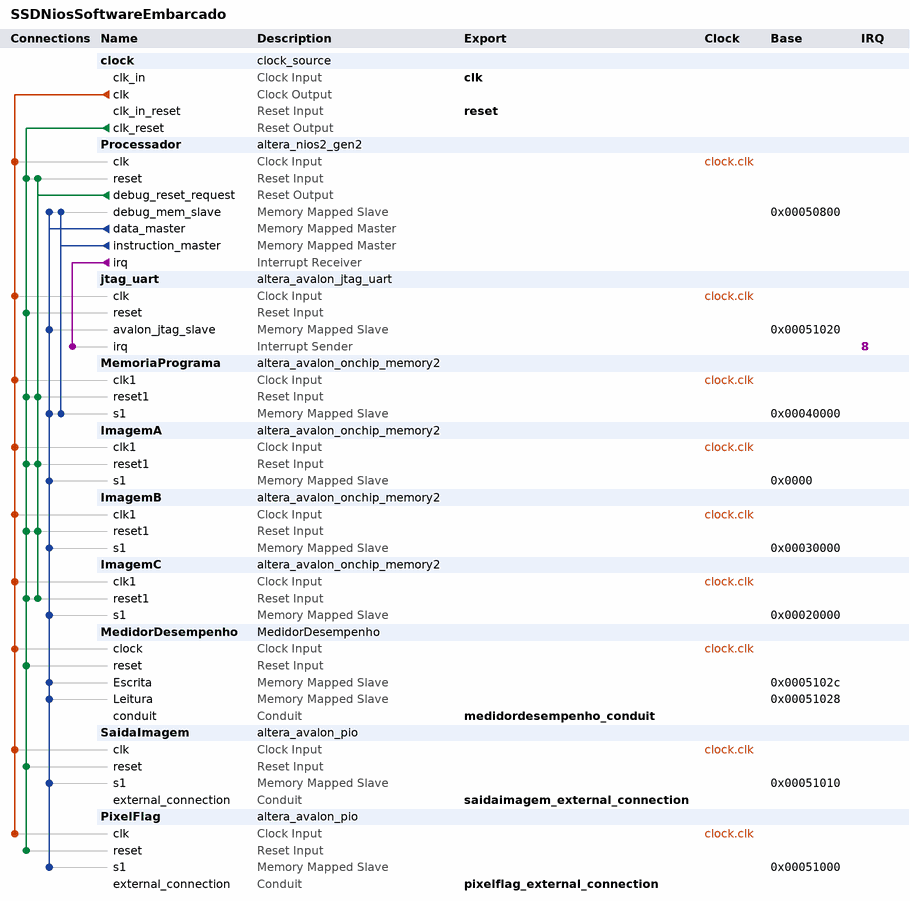
[diagram p0: system contents]
# Platform Designer (Qsys) system SSDNiosSoftwareEmbarcado, Cyclone IV E EP4CE115F29C7
# Parameters at their usual value, and those the tool derives, are not listed.
package require -exact qsys 18.1
create_system SSDNiosSoftwareEmbarcado
set_project_property DEVICE_FAMILY {Cyclone IV E}
set_project_property DEVICE EP4CE115F29C7

add_instance clock clock_source 18.1
set_instance_parameter_value clock clockFrequency 50000000

add_instance Processador altera_nios2_gen2 18.1
set_instance_parameter_value Processador dcache_size 2048
set_instance_parameter_value Processador exceptionSlave MemoriaPrograma.s1
set_instance_parameter_value Processador icache_size 4096
set_instance_parameter_value Processador impl Tiny
set_instance_parameter_value Processador resetSlave MemoriaPrograma.s1

add_instance jtag_uart altera_avalon_jtag_uart 18.1
set_instance_parameter_value jtag_uart simInteractiveOptions NO_INTERACTIVE_WINDOWS

add_instance MemoriaPrograma altera_avalon_onchip_memory2 18.1
set_instance_parameter_value MemoriaPrograma dataWidth 8
set_instance_parameter_value MemoriaPrograma dualPort false
set_instance_parameter_value MemoriaPrograma initMemContent true
set_instance_parameter_value MemoriaPrograma initializationFileName onchip_mem.hex
set_instance_parameter_value MemoriaPrograma memorySize 65536

add_instance ImagemA altera_avalon_onchip_memory2 18.1
set_instance_parameter_value ImagemA allowInSystemMemoryContentEditor true
set_instance_parameter_value ImagemA dataWidth 8
set_instance_parameter_value ImagemA dualPort false
set_instance_parameter_value ImagemA initMemContent true
set_instance_parameter_value ImagemA initializationFileName C:/Projetos/Quartus/SSDNiosSoftware/ImagemA.mif
set_instance_parameter_value ImagemA instanceID DATA
set_instance_parameter_value ImagemA memorySize 65536
set_instance_parameter_value ImagemA useNonDefaultInitFile true
set_instance_parameter_value ImagemA writable false

add_instance ImagemB altera_avalon_onchip_memory2 18.1
set_instance_parameter_value ImagemB allowInSystemMemoryContentEditor true
set_instance_parameter_value ImagemB dataWidth 8
set_instance_parameter_value ImagemB dualPort false
set_instance_parameter_value ImagemB initMemContent true
set_instance_parameter_value ImagemB initializationFileName C:/Projetos/Quartus/SSDNiosSoftware/ImagemB.mif
set_instance_parameter_value ImagemB instanceID DATA
set_instance_parameter_value ImagemB memorySize 65536
set_instance_parameter_value ImagemB useNonDefaultInitFile true
set_instance_parameter_value ImagemB writable false

add_instance ImagemC altera_avalon_onchip_memory2 18.1
set_instance_parameter_value ImagemC dataWidth 8
set_instance_parameter_value ImagemC dualPort false
set_instance_parameter_value ImagemC initMemContent true
set_instance_parameter_value ImagemC initializationFileName onchip_mem.hex
set_instance_parameter_value ImagemC memorySize 65536

add_instance MedidorDesempenho MedidorDesempenho 1.0

add_instance SaidaImagem altera_avalon_pio 18.1
set_instance_parameter_value SaidaImagem direction Output
set_instance_parameter_value SaidaImagem width 8

add_instance PixelFlag altera_avalon_pio 18.1
set_instance_parameter_value PixelFlag direction Output
set_instance_parameter_value PixelFlag width 1

# connections
add_connection clock.clk ImagemA.clk1 clock
add_connection clock.clk ImagemB.clk1 clock
add_connection clock.clk ImagemC.clk1 clock
add_connection clock.clk jtag_uart.clk clock
add_connection clock.clk MedidorDesempenho.clock clock
add_connection clock.clk MemoriaPrograma.clk1 clock
add_connection clock.clk PixelFlag.clk clock
add_connection clock.clk Processador.clk clock
add_connection clock.clk SaidaImagem.clk clock
add_connection clock.clk_reset ImagemA.reset1 reset
add_connection clock.clk_reset ImagemB.reset1 reset
add_connection clock.clk_reset ImagemC.reset1 reset
add_connection clock.clk_reset jtag_uart.reset reset
add_connection clock.clk_reset MedidorDesempenho.reset reset
add_connection clock.clk_reset MemoriaPrograma.reset1 reset
add_connection clock.clk_reset PixelFlag.reset reset
add_connection clock.clk_reset Processador.reset reset
add_connection clock.clk_reset SaidaImagem.reset reset
add_connection Processador.debug_reset_request ImagemA.reset1 reset
add_connection Processador.debug_reset_request ImagemB.reset1 reset
add_connection Processador.debug_reset_request ImagemC.reset1 reset
add_connection Processador.debug_reset_request MemoriaPrograma.reset1 reset
add_connection Processador.debug_reset_request Processador.reset reset
add_connection Processador.data_master ImagemA.s1 avalon
set_connection_parameter_value Processador.data_master/ImagemA.s1 baseAddress 0x0000
add_connection Processador.data_master ImagemB.s1 avalon
set_connection_parameter_value Processador.data_master/ImagemB.s1 baseAddress 0x00030000
add_connection Processador.data_master ImagemC.s1 avalon
set_connection_parameter_value Processador.data_master/ImagemC.s1 baseAddress 0x00020000
add_connection Processador.data_master jtag_uart.avalon_jtag_slave avalon
set_connection_parameter_value Processador.data_master/jtag_uart.avalon_jtag_slave baseAddress 0x00051020
add_connection Processador.data_master MedidorDesempenho.Escrita avalon
set_connection_parameter_value Processador.data_master/MedidorDesempenho.Escrita baseAddress 0x0005102c
add_connection Processador.data_master MedidorDesempenho.Leitura avalon
set_connection_parameter_value Processador.data_master/MedidorDesempenho.Leitura baseAddress 0x00051028
add_connection Processador.data_master MemoriaPrograma.s1 avalon
set_connection_parameter_value Processador.data_master/MemoriaPrograma.s1 baseAddress 0x00040000
add_connection Processador.data_master PixelFlag.s1 avalon
set_connection_parameter_value Processador.data_master/PixelFlag.s1 baseAddress 0x00051000
add_connection Processador.data_master Processador.debug_mem_slave avalon
set_connection_parameter_value Processador.data_master/Processador.debug_mem_slave baseAddress 0x00050800
add_connection Processador.data_master SaidaImagem.s1 avalon
set_connection_parameter_value Processador.data_master/SaidaImagem.s1 baseAddress 0x00051010
add_connection Processador.instruction_master MemoriaPrograma.s1 avalon
set_connection_parameter_value Processador.instruction_master/MemoriaPrograma.s1 baseAddress 0x00040000
add_connection Processador.instruction_master Processador.debug_mem_slave avalon
set_connection_parameter_value Processador.instruction_master/Processador.debug_mem_slave baseAddress 0x00050800
add_connection Processador.irq jtag_uart.irq interrupt
set_connection_parameter_value Processador.irq/jtag_uart.irq irqNumber 8

# exported interfaces
add_interface clk clock sink
set_interface_property clk EXPORT_OF clock.clk_in
add_interface medidordesempenho_conduit conduit end
set_interface_property medidordesempenho_conduit EXPORT_OF MedidorDesempenho.conduit
add_interface pixelflag_external_connection conduit end
set_interface_property pixelflag_external_connection EXPORT_OF PixelFlag.external_connection
add_interface reset reset sink
set_interface_property reset EXPORT_OF clock.clk_in_reset
add_interface saidaimagem_external_connection conduit end
set_interface_property saidaimagem_external_connection EXPORT_OF SaidaImagem.external_connection

set_interconnect_requirement {$system} qsys_mm.clockCrossingAdapter HANDSHAKE
set_interconnect_requirement {$system} qsys_mm.enableEccProtection FALSE
set_interconnect_requirement {$system} qsys_mm.insertDefaultSlave FALSE
set_interconnect_requirement {$system} qsys_mm.maxAdditionalLatency 1

save_system SSDNiosSoftwareEmbarcado.qsys
